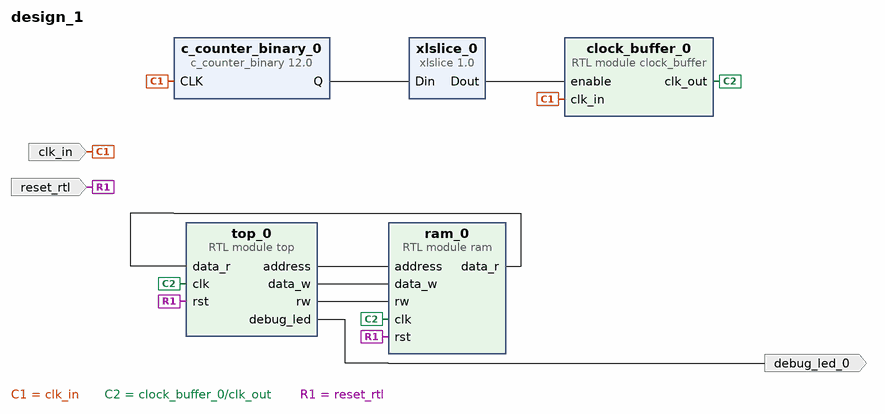
[diagram p0: block diagram of the top level]
# Vivado block design design_1, xc7z020clg400-1, Vivado 2023.1
create_bd_design design_1

create_bd_port -dir I -type clk clk_in
set_property -dict {CONFIG.ASSOCIATED_RESET reset_rtl CONFIG.FREQ_HZ 125000000 CONFIG.PHASE 0.0} [get_bd_ports clk_in]
create_bd_port -dir O debug_led_0
create_bd_port -dir I -type rst reset_rtl
set_property -dict {CONFIG.POLARITY ACTIVE_HIGH} [get_bd_ports reset_rtl]

create_bd_cell -type ip -vlnv xilinx.com:ip:c_counter_binary:12.0 c_counter_binary_0
set_property -dict {CONFIG.Output_Width 28} [get_bd_cells c_counter_binary_0]
create_bd_cell -type ip -vlnv xilinx.com:ip:xlslice:1.0 xlslice_0
set_property -dict {CONFIG.DIN_FROM 27 CONFIG.DIN_TO 27 CONFIG.DIN_WIDTH 28} [get_bd_cells xlslice_0]
create_bd_cell -type module -reference clock_buffer clock_buffer_0
create_bd_cell -type module -reference top top_0
create_bd_cell -type module -reference ram ram_0

# ---- connections ----

connect_bd_net [get_bd_pins c_counter_binary_0/Q] [get_bd_pins xlslice_0/Din]
connect_bd_net [get_bd_ports clk_in] [get_bd_pins c_counter_binary_0/CLK] [get_bd_pins clock_buffer_0/clk_in]
connect_bd_net -net clock_buffer_0_clk_out [get_bd_pins top_0/debug_led] [get_bd_ports debug_led_0]
connect_bd_net [get_bd_pins clock_buffer_0/clk_out] [get_bd_pins top_0/clk] [get_bd_pins ram_0/clk]
connect_bd_net [get_bd_pins ram_0/data_r] [get_bd_pins top_0/data_r]
connect_bd_net [get_bd_ports reset_rtl] [get_bd_pins top_0/rst] [get_bd_pins ram_0/rst]
connect_bd_net [get_bd_pins top_0/address] [get_bd_pins ram_0/address]
connect_bd_net [get_bd_pins top_0/data_w] [get_bd_pins ram_0/data_w]
connect_bd_net [get_bd_pins top_0/rw] [get_bd_pins ram_0/rw]
connect_bd_net [get_bd_pins xlslice_0/Dout] [get_bd_pins clock_buffer_0/enable]

validate_bd_design
save_bd_design
